# Altium schematic sheet 1.5KW CHE.SchDoc
size A2; PageSetup: Record=PageOptions|CenterHorizontal=True|CenterVertical=True|PrintScale=0.71|XCorrection=1.00|YCorrection=1.00|PrintKind=1|BorderSize=5000000|LeftOffset=0|BottomOffset=0|Orientation=2|PaperLength=1000|PaperWidth=1000|Scale=100|PaperSource=15|PrintQuality=600|MediaType=1|DitherType=10|PaperKind=A3|PrintScaleMode=1
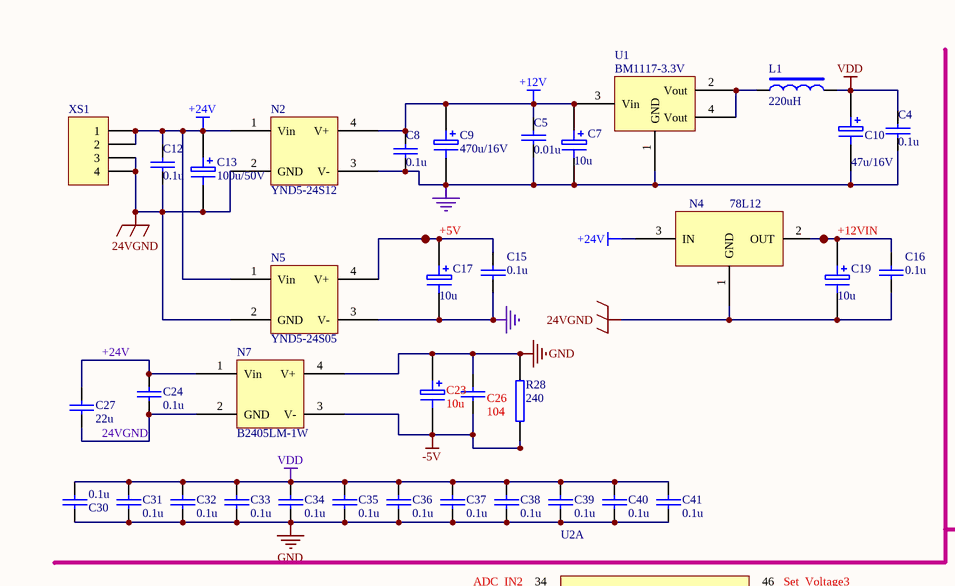
[diagram p0: 1.5KW CHE.SchDoc, top left]
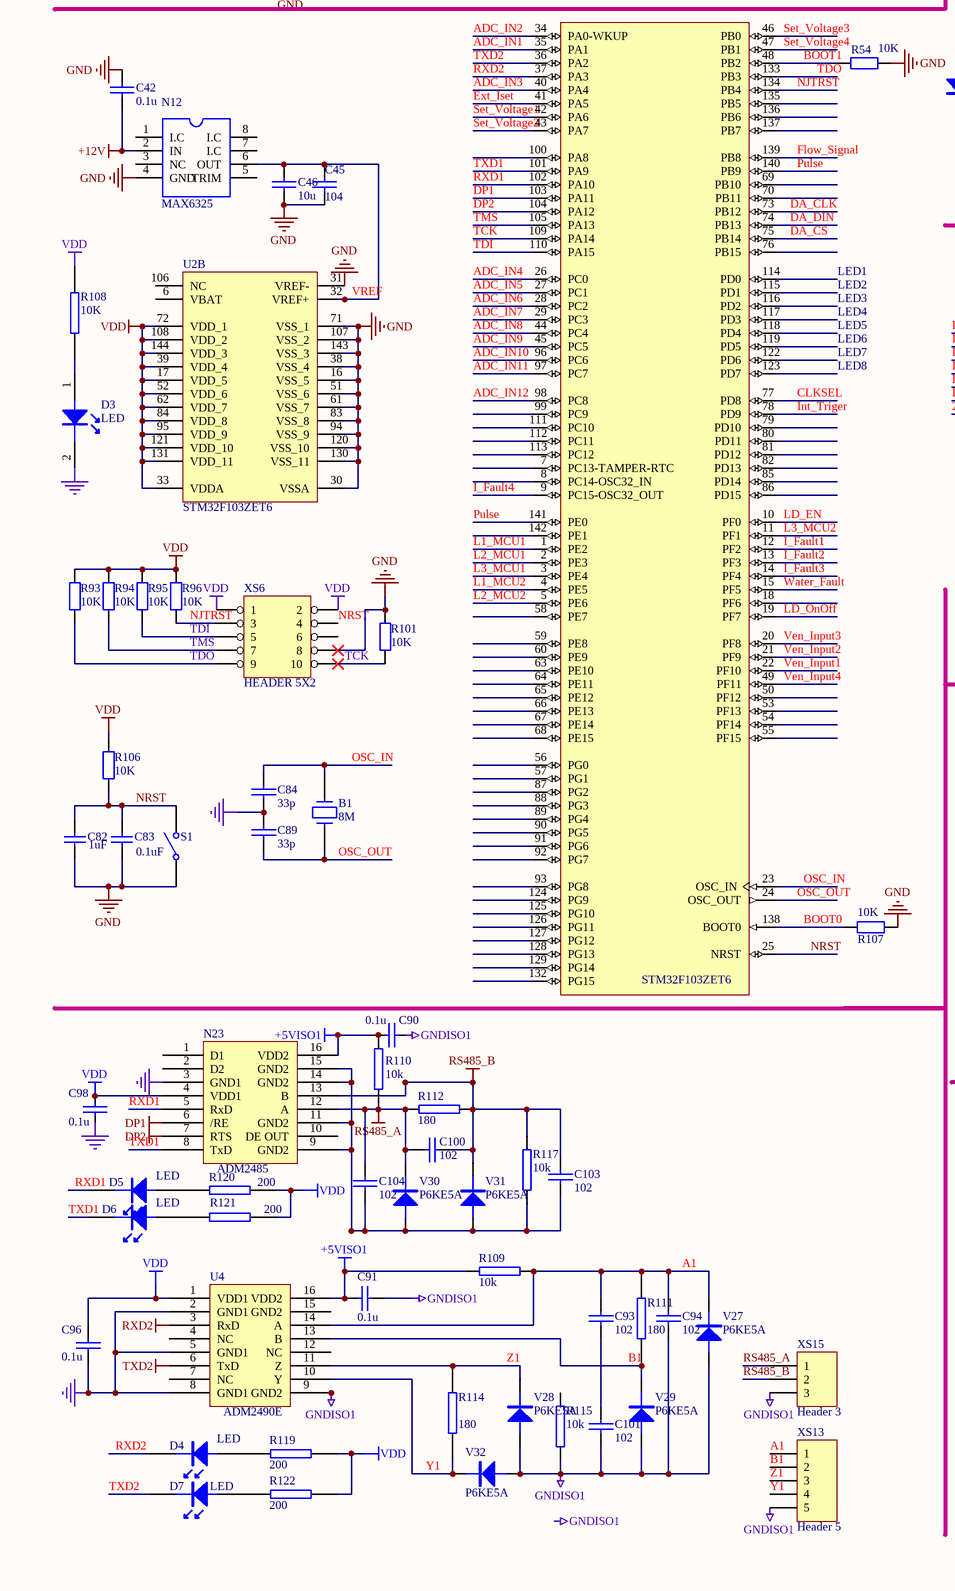
[diagram p1: 1.5KW CHE.SchDoc, bottom left]
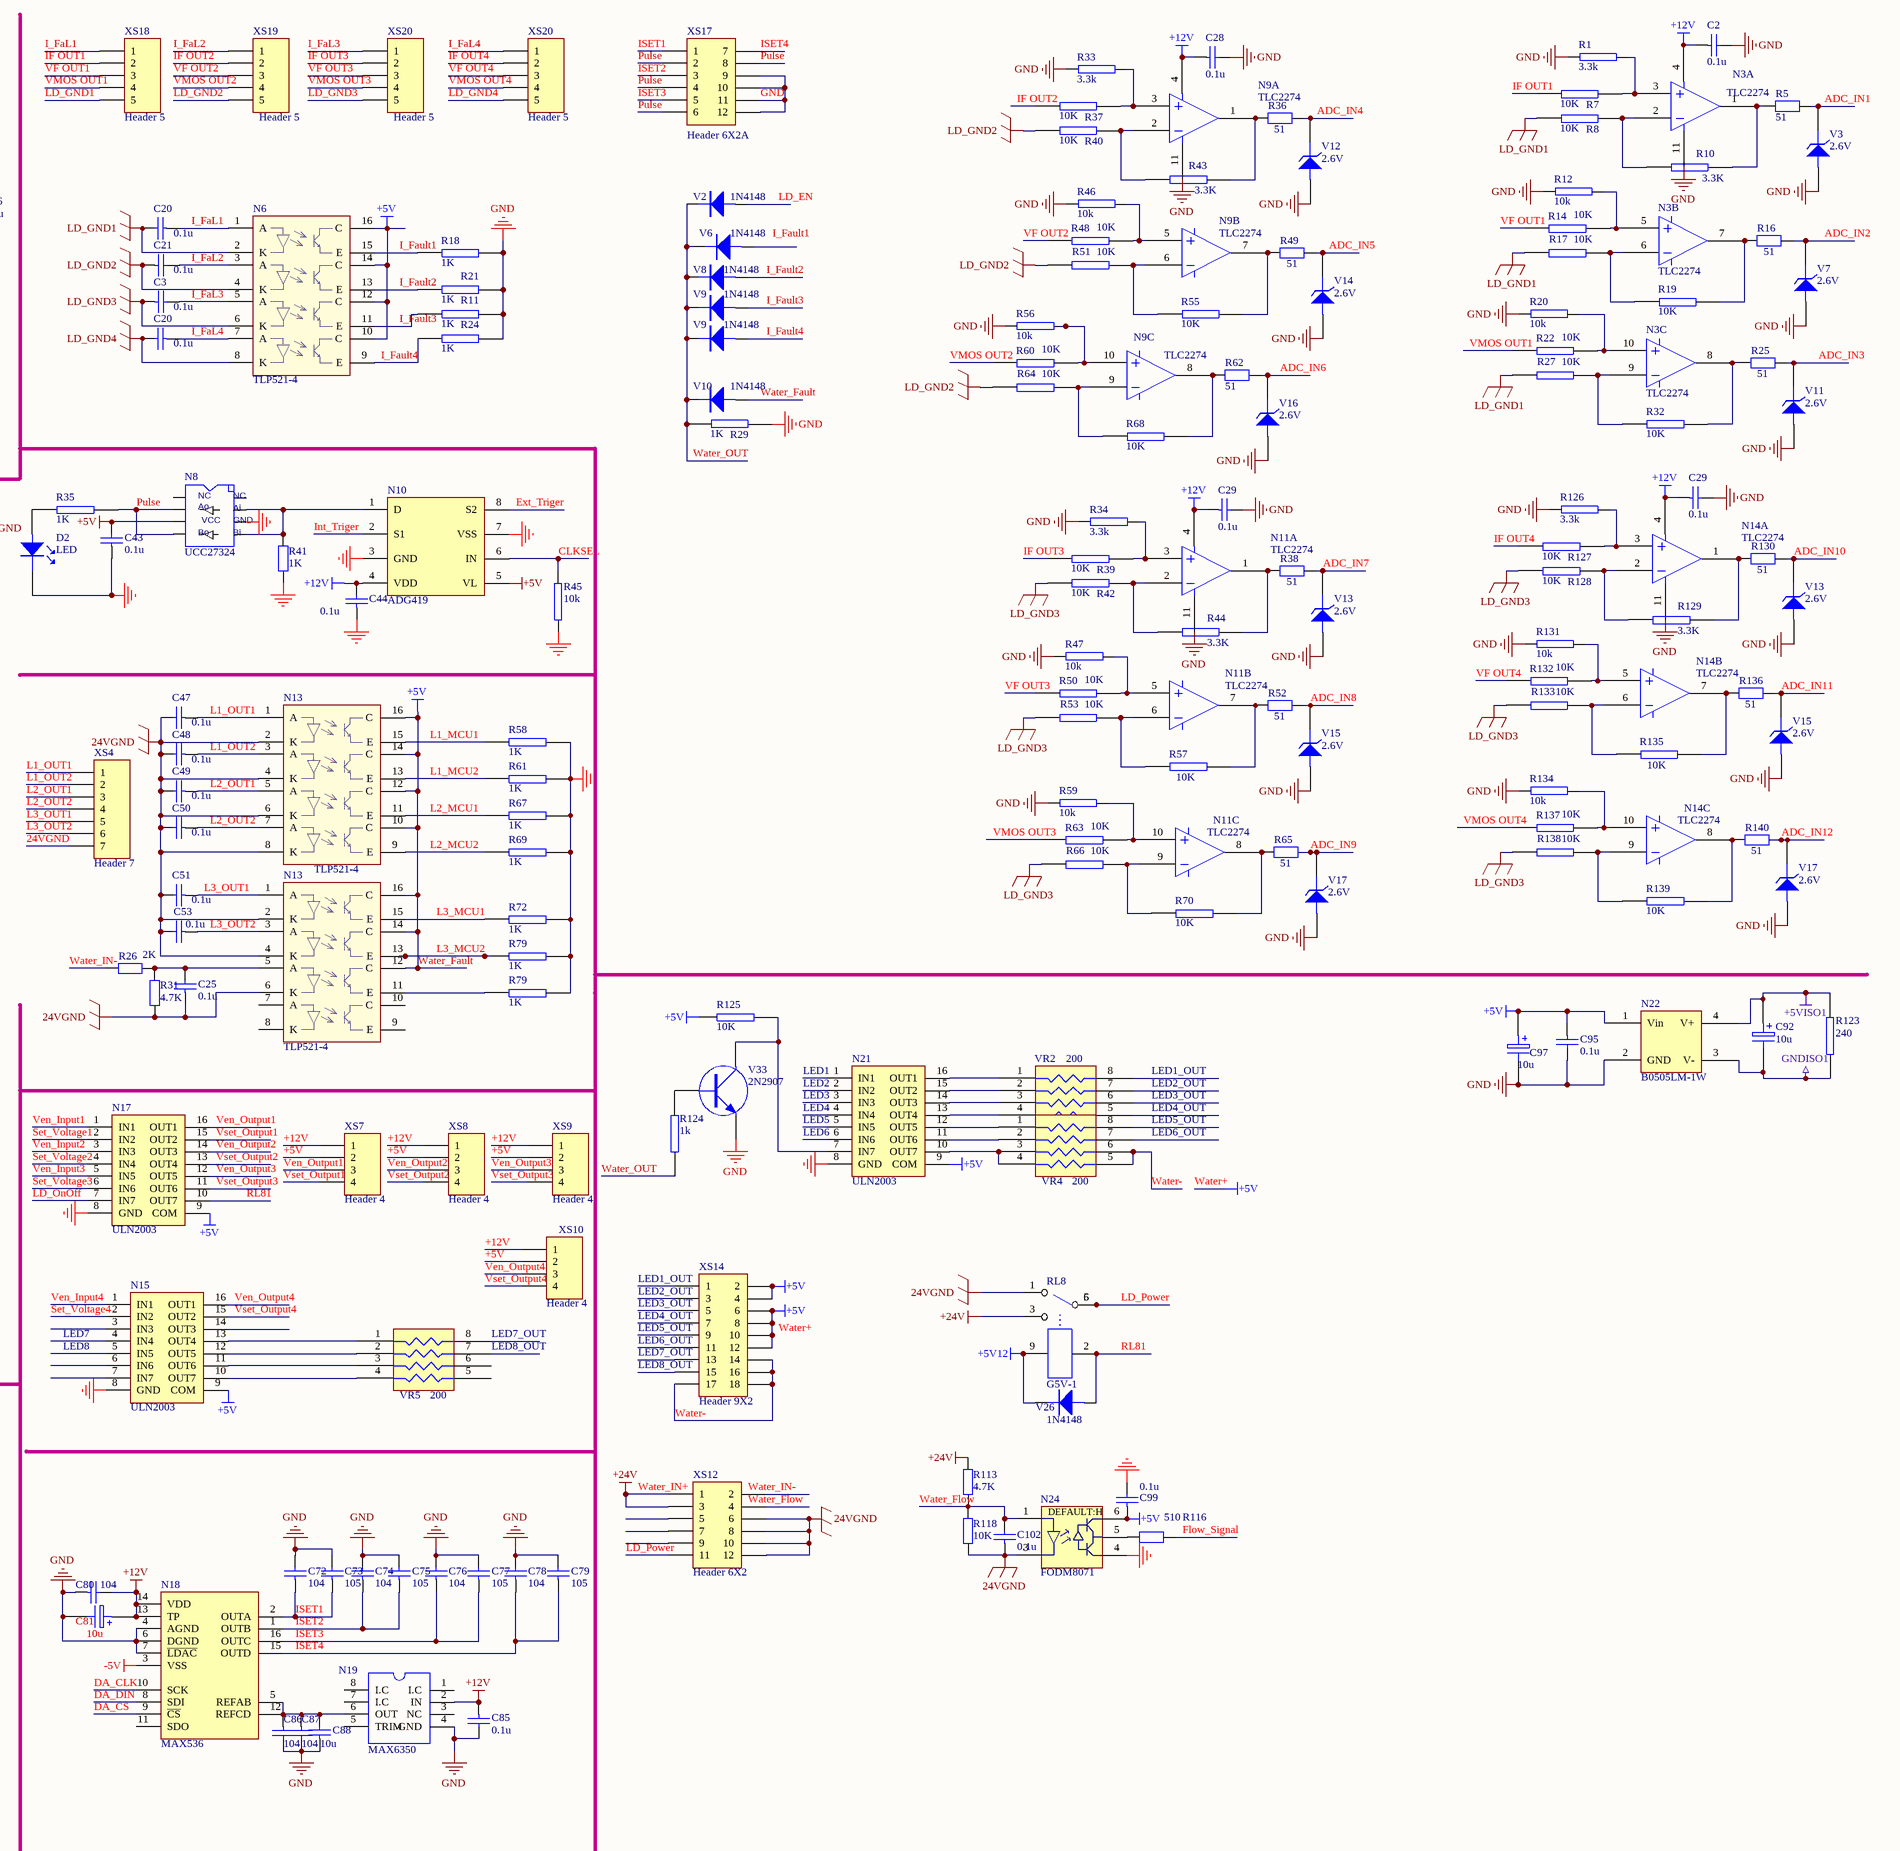
[diagram p2: 1.5KW CHE.SchDoc, bottom right]

## Parts
(Parts that share a designator on the sheet are numbered #1, #2 ... from top to bottom, then left to right.)
B1  8M  [CRY_SMB]
C2  0.1u  [0805]
C3  0.1u  [0805]
C4  0.1u  [0805]
C5  0.01u  [0805]
C7  10u  [1206]
C8  0.1u  [0805]
C9  470u/16V  [3008]
C10  47u/16V  [1206]
C12  0.1u  [0805]
C13  100u/50V  [CD5-8]
C15  0.1u  [0805]
C16  0.1u  [0805]
C17  10u  [1206]
C19  10u  [1206]
C20#1  0.1u  [0805]
C20#2  0.1u  [0805]
C21  0.1u  [0805]
C23  10u  [1206]
C24  0.1u  [0805]
C25  0.1u  [0805]
C26  104  [0805]
C27  22u  [1206]
C28  0.1u  [0805]
C29#1  0.1u  [0805]
C29#2  0.1u  [0805]
C30  0.1u  [0805]
C31  0.1u  [0805]
C32  0.1u  [0805]
C33  0.1u  [0805]
C34  0.1u  [0805]
C35  0.1u  [0805]
C36  0.1u  [0805]
C37  0.1u  [0805]
C38  0.1u  [0805]
C39  0.1u  [0805]
C40  0.1u  [0805]
C41  0.1u  [0805]
C42  0.1u  [0805]
C43  0.1u  [0805]
C44  0.1u  [0805]
C45  104  [0805]
C46  10u  [0805]
C47  0.1u  [0805]
C48  0.1u  [0805]
C49  0.1u  [0805]
C50  0.1u  [0805]
C51  0.1u  [0805]
C53  0.1u  [0805]
C72  104  [0805]
C73  105  [0805]
C74  104  [0805]
C75  105  [0805]
C76  104  [0805]
C77  105  [0805]
C78  104  [0805]
C79  105  [0805]
C80  104  [0805]
C81  10u  [1206]
C82  1uF  [0805]
C83  0.1uF  [0805]
C84  33p  [0805]
C85  0.1u  [0805]
C86  104  [0805]
C87  104  [0805]
C88  10u  [0805]
C89  33p  [0805]
C90  0.1u  [0805]
C91  0.1u  [0805]
C92  10u  [1206]
C93  102  [0805]
C94  102  [0805]
C95  0.1u  [0805]
C96  0.1u  [0805]
C97  10u  [1206]
C98  0.1u  [0805]
C99  0.1u  [0805]
C100  102  [0805]
C101  102  [0805]
C102  0.1u  [0805]
C103  102  [0805]
C104  102  [0805]
D2  LED  [1206A]
D3  LED  [1206A]
D4  LED  [1206A]
D5  LED  [1206A]
D6  LED  [1206A]
D7  LED  [1206A]
L1  220uH  [1812]
N2  YND5-24S12  [YND5]
N3  TLC2274  [SO-14]  (parts A,B,C of 4)
N4  78L12  [TO-92_2]
N5  YND5-24S05  [YND5]
N6  TLP521-4  [ILEAD-16]
N7  B2405LM-1W  [B0505LM]
N8  UCC27324  [SO-8]
N9  TLC2274  [SO-14]  (parts A,B,C of 4)
N10  ADG419  [SO-8]
N11  TLC2274  [SO-14]  (parts A,B,C of 4)
N12  MAX6325  [SO-8]
N13#1  TLP521-4  [ILEAD-16]
N13#2  TLP521-4  [ILEAD-16]
N14  TLC2274  [SO-14]  (parts A,B,C of 4)
N15  ULN2003  [SOIC127P600-16N]
N17  ULN2003  [SOIC127P600-16N]
N18  MAX536  [SOIC-16]
N19  MAX6350  [SO-8]
N21  ULN2003  [SOIC127P600-16N]
N22  B0505LM-1W  [B0505LM]
N23  ADM2485  [SOIC-16]
N24  FODM8071  [SO-8]
R1  3.3k  [0805]
R5  51  [0805]
R7  10K  [0805]
R8  10K  [0805]
R10  3.3K  [0805]
R11  1K  [0805]
R12  10k  [0805]
R14  10K  [0805]
R16  51  [0805]
R17  10K  [0805]
R18  1K  [0805]
R19  10K  [0805]
R20  10k  [0805]
R21  1K  [0805]
R22  10K  [0805]
R24  1K  [0805]
R25  51  [0805]
R26  2K  [0805]
R27  10K  [0805]
R28  240  [1206]
R29  1K  [0805]
R31  4.7K  [0805]
R32  10K  [0805]
R33  3.3k  [0805]
R34  3.3k  [0805]
R35  1K  [0805]
R36  51  [0805]
R37  10K  [0805]
R38  51  [0805]
R39  10K  [0805]
R40  10K  [0805]
R41  1K  [0805]
R42  10K  [0805]
R43  3.3K  [0805]
R44  3.3K  [0805]
R45  10k  [0805]
R46  10k  [0805]
R47  10k  [0805]
R48  10K  [0805]
R49  51  [0805]
R50  10K  [0805]
R51  10K  [0805]
R52  51  [0805]
R53  10K  [0805]
R54  10K  [0805]
R55  10K  [0805]
R56  10k  [0805]
R57  10K  [0805]
R58  1K  [0805]
R59  10k  [0805]
R60  10K  [0805]
R61  1K  [0805]
R62  51  [0805]
R63  10K  [0805]
R64  10K  [0805]
R65  51  [0805]
R66  10K  [0805]
R67  1K  [0805]
R68  10K  [0805]
R69  1K  [0805]
R70  10K  [0805]
R72  1K  [0805]
R79#1  1K  [0805]
R79#2  1K  [0805]
R93  10K  [0805]
R94  10K  [0805]
R95  10K  [0805]
R96  10K  [0805]
R101  10K  [0805]
R106  value 10K  [0805]  (hidden comment: Res2)
R107  10K  [0805]
R108  10K  [0805]
R109  10k  [0805]
R110  10k  [0805]
R111  180  [1206]
R112  180  [1206]
R113  4.7K  [0805]
R114  180  [1206]
R115  10k  [0805]
R116  510  [0805]
R117  10k  [0805]
R118  10K  [0805]
R119  200  [0805]
R120  200  [0805]
R121  200  [0805]
R122  200  [0805]
R123  240  [1206]
R124  1k  [1206]
R125  10K  [0805]
R126  3.3k  [0805]
R127  10K  [0805]
R128  10K  [0805]
R129  3.3K  [0805]
R130  51  [0805]
R131  10k  [0805]
R132  10K  [0805]
R133  10K  [0805]
R134  10k  [0805]
R135  10K  [0805]
R136  51  [0805]
R137  10K  [0805]
R138  10K  [0805]
R139  10K  [0805]
R140  51  [0805]
RL8  G5V-1  [G5V-1]
S1  SW-SPST  [KEY_3*6*2.5]  (value not drawn)
U1  BM1117-3.3V  [SOT-223]
U2  STM32F103ZET6  [LQFP144_N]  (parts A,B of 2)
U4  ADM2490E  [SOIC-16]
V2  1N4148  [1206A]
V3  2.6V  [1206A]
V6  1N4148  [1206A]
V7  2.6V  [1206A]
V8  1N4148  [1206A]
V9#1  1N4148  [1206A]
V9#2  1N4148  [1206A]
V10  1N4148  [1206A]
V11  2.6V  [1206A]
V12  2.6V  [1206A]
V13#1  2.6V  [1206A]
V13#2  2.6V  [1206A]
V14  2.6V  [1206A]
V15#1  2.6V  [1206A]
V15#2  2.6V  [1206A]
V16  2.6V  [1206A]
V17#1  2.6V  [1206A]
V17#2  2.6V  [1206A]
V26  1N4148  [1206A]
V27  P6KE5A  [1206-D]
V28  P6KE5A  [1206-D]
V29  P6KE5A  [1206-D]
V30  P6KE5A  [1206-D]
V31  P6KE5A  [1206-D]
V32  P6KE5A  [1206-D]
V33  2N2907  [SOT-23]
VR2  200  [MINZIP]
VR4  200  [MINZIP]
VR5  200  [MINZIP]
XS1  Header 4  [SIP-4]  (value not drawn)
XS4  Header 7  [SIP-7]
XS6  HEADER 5X2  [PHD-2*5]
XS7  Header 4  [SIP-4]
XS8  Header 4  [SIP-4]
XS9  Header 4  [SIP-4]
XS10  Header 4  [SIP-4]
XS12  Header 6X2  [PHD-2*6]
XS13  Header 5  [SIP-5]
XS14  Header 9X2  [PHD-2*9]
XS15  Header 3  [SIP-3]
XS17  Header 6X2A  [HDR2X6_CEN]
XS18  Header 5  [SIP-5]
XS19  Header 5  [SIP-5]
XS20#1  Header 5  [SIP-5]
XS20#2  Header 5  [SIP-5]

## Nets
24VGND: C12.2 C13.2 C16.2 C19.2 C24.1 C25.1 C27.1 C47.2 C48.2 C49.2 C50.2 C51.2 C53.2 C102.1 N2.2(GND) N4.1(GND) N5.2(GND) N7.2(GND) N13#1.2(K) N13#1.4(K) N13#1.6(K) N13#1.8(K) N13#2.2(K) N13#2.4(K) N13#2.6(K) N24.3(IN-) R31.2 R118.2 RL8.1 XS1.3 XS1.4 XS4.7 XS12.6 XS12.8 XS12.10 XS12.12
+5V: C15.1 C17.1 C43.2 C95.1 C97.1 C99.1 N5.4(V+) N6.10(C) N6.12(C) N6.14(C) N6.16(C) N8.6(VCC) N10.5(VL) N13#1.10(C) N13#1.12(C) N13#1.14(C) N13#1.16(C) N13#2.12(C) N13#2.14(C) N13#2.16(C) N15.9(COM) N17.9(COM) N21.9(COM) N22.1(Vin) N24.6(VDD) U2.15(PF5) V10.1(A) XS7.2 XS8.2 XS9.2 XS10.2 XS14.2 XS14.4 XS14.6 XS14.8 XS14.10 XS14.12  [also labelled Water+, Water_Fault]
+5V12: RL8.9 V26.2(K)
+5VISO1: C90.2 C91.2 C92.1 N22.4(V+) N23.16(VDD2) R109.1 R110.1 R123.2 U4.16(VDD2)
+12V: C2.1 C5.1 C7.1 C8.1 C9.1 C28.1 C29#1.1 C29#2.1 C42.1 C44.2 C80.2 C81.1 C85.1 N2.4(V+) N3.4 N9.4 N10.4(VDD) N11.4 N12.2(IN) N14.4 N18.13(TP) N18.14(VDD) N19.2(IN) U1.3(Vin) XS7.1 XS8.1 XS9.1 XS10.1
+24V: C12.1 C13.1 C24.2 C27.2 N2.1(Vin) N4.3(IN) N5.1(Vin) N7.1(Vin) R113.2 RL8.3 XS1.1 XS1.2 XS12.1 XS12.3  [also labelled Water_IN+]
-5V: C23.2 C26.2 N7.3(V-) N18.3(VSS) R28.1
DP1: N23.6(/RE) U2.103(PA11)
DP2: N23.7(RTS) U2.104(PA12)
GND: C2.2 C4.2 C5.2 C7.2 C8.2 C9.2 C10.2 C15.2 C17.2 C23.1 C26.1 C28.2 C29#1.2 C29#2.2 C30.2 C31.2 C32.2 C33.2 C34.2 C35.2 C36.2 C37.2 C38.2 C39.2 C40.2 C41.2 C42.2 C43.1 C44.1 C45.2 C46.1 C72.2 C73.2 C74.2 C75.2 C76.2 C77.2 C78.2 C79.2 C80.1 C81.2 C82.1 C83.1 C84.2 C85.2 C86.2 C87.2 C88.1 C89.1 C95.2 C96.2 C97.2 C98.2 C99.2 D2.2 D3.2 N2.3(V-) N3.11 N5.3(V-) N7.4(V+) N8.3(GND) N9.11 N10.3(GND) N10.7(VSS) N11.11 N12.4(GND) N14.11 N15.8(GND) N17.8(GND) N18.4(AGND) N18.6(DGND) N18.7(~{LDAC}) N19.4(GND) N21.8(GND) N22.2(GND) N23.3(GND1) N24.4(GND) R1.2 R11.2 R12.2 R18.2 R20.2 R21.2 R24.2 R28.2 R29.1 R33.2 R34.2 R41.2 R45.1 R46.2 R47.2 R54.1 R56.2 R58.2 R59.2 R61.2 R67.2 R69.2 R72.2 R79#1.2 R79#2.2 R101.1 R107.1 R126.2 R131.2 R134.2 S1.1(COMMON) U1.1(GND) U2.16(VSS_5) U2.30(VSSA) U2.31(VREF-) U2.38(VSS_4) U2.51(VSS_6) U2.61(VSS_7) U2.71(VSS_1) U2.83(VSS_8) U2.94(VSS_9) U2.107(VSS_2) U2.120(VSS_10) U2.130(VSS_11) U2.143(VSS_3) U4.2(GND1) U4.5(GND1) U4.8(GND1) V3.1(A) V7.1(A) V11.1(A) V12.1(A) V13#1.1(A) V13#2.1(A) V14.1(A) V15#1.1(A) V15#2.1(A) V16.1(A) V17#1.1(A) V17#2.1(A) V33.2(E) XS6.8 XS17.9 XS17.10 XS17.11 XS17.12
GNDISO1: C90.1 C91.1 C92.2 C94.2 C101.2 N22.3(V-) R115.2 R123.1 U4.9(GND2) V27.A V28.A V29.A V32.A XS13.5 XS15.3
LD_GND1: C20#1.2 N6.2(K) R8.1 R17.1 R27.1 XS18.5
LD_GND2: C21.1 N6.4(K) R40.1 R51.1 R64.1 XS19.5
LD_GND3: C3.1 N6.6(K) R42.1 R53.1 R66.1 R128.1 R133.1 R138.1 XS20#1.5
LD_GND4: C20#2.2 N6.8(K) XS20#2.5
RS485_A: C100.1 C104.1 N23.12(A) R110.2 R112.1 V30.K XS15.1
RS485_B: C100.2 C103.1 N23.13(B) R112.2 R117.1 V31.K XS15.2
RXD2: D4.2 U2.37(PA3) U4.3(RxD)
TXD2: D7.2 U2.36(PA2) U4.6(TxD)
VDD: C4.1 C10.1 C30.1 C31.1 C32.1 C33.1 C34.1 C35.1 C36.1 C37.1 C38.1 C39.1 C40.1 C41.1 C96.1 C98.1 L1.2 N23.4(VDD1) R93.1 R94.1 R95.1 R96.1 R106.2 R108.1 R119.2 R120.2 R121.2 R122.2 U2.17(VDD_5) U2.33(VDDA) U2.39(VDD_4) U2.52(VDD_6) U2.62(VDD_7) U2.72(VDD_1) U2.84(VDD_8) U2.95(VDD_9) U2.108(VDD_2) U2.121(VDD_10) U2.131(VDD_11) U2.144(VDD_3) U4.1(VDD1) XS6.1 XS6.2
+12VIN: C16.1 C19.1 N4.2(OUT)
A1: C93.1 C94.1 R109.2 R111.1 U4.14(A) V27.K XS13.1
ADC_IN1: R5.1 U2.35(PA1) V3.2(K)
ADC_IN2: R16.1 U2.34(PA0-WKUP) V7.2(K)
ADC_IN3: R25.1 U2.40(PA4) V11.2(K)
ADC_IN4: R36.1 U2.26(PC0) V12.2(K)
ADC_IN5: R49.1 U2.27(PC1) V14.2(K)
ADC_IN6: R62.1 U2.28(PC2) V16.2(K)
ADC_IN7: R38.1 U2.29(PC3) V13#2.2(K)
ADC_IN8: R52.1 U2.44(PC4) V15#2.2(K)
ADC_IN9: R65.1 U2.45(PC5) V17#2.2(K)
ADC_IN10: R130.1 U2.96(PC6) V13#1.2(K)
ADC_IN11: R136.1 U2.97(PC7) V15#1.2(K)
ADC_IN12: R140.1 U2.98(PC8) V17#1.2(K)
B1: R111.2 U4.13(B) V29.K XS13.2
BOOT0: R107.2 U2.138(BOOT0)
BOOT1: R54.2 U2.48(PB2)
CLKSEL: N10.6(IN) R45.2 U2.77(PD8)
DA_CLK: N18.10(SCK) U2.73(PB12)
DA_CS: N18.9(~{CS}) U2.75(PB14)
DA_DIN: N18.8(SDI) U2.74(PB13)
Ext_Iset: U2.41(PA5)
Ext_Triger: N10.8(S2)
Flow_Signal: R116.1 U2.139(PB8)
I_FaL1: C20#1.1 N6.1(A) XS18.1
I_FaL2: C21.2 N6.3(A) XS19.1
I_FaL3: C3.2 N6.5(A) XS20#1.1
I_FaL4: C20#2.1 N6.7(A) XS20#2.1
I_Fault1: N6.15(E) R18.1 U2.12(PF2)
I_Fault2: N6.13(E) R21.1 U2.13(PF3) V8.1(A)
I_Fault3: N6.11(E) R11.1 U2.14(PF4) V9#1.1(A)
I_Fault4: N6.9(E) R24.1 U2.9(PC15-OSC32_OUT) V9#2.1(A)
IF OUT1: R7.1 XS18.2
IF OUT2: R37.1 XS19.2
IF OUT3: R39.1 XS20#1.2
IF OUT4: R127.1 XS20#2.2
Int_Triger: N10.2(S1) U2.78(PD9)
ISET1: C72.1 C73.1 N18.2(OUTA) XS17.ISET1(1)
ISET2: C74.1 C75.1 N18.1(OUTB) XS17.3
ISET3: C76.1 C77.1 N18.16(OUTC) XS17.5
ISET4: C78.1 C79.1 N18.15(OUTD) XS17.7
L1_MCU1: N13#1.15(E) R58.1 U2.1(PE2)
L1_MCU2: N13#1.13(E) R61.1 U2.4(PE5)
L1_OUT1: C47.1 N13#1.1(A) XS4.1
L1_OUT2: C48.1 N13#1.3(A) XS4.2
L2_MCU1: N13#1.11(E) R67.1 U2.2(PE3)
L2_MCU2: N13#1.9(E) R69.1 U2.5(PE6)
L2_OUT1: C49.1 N13#1.5(A) XS4.3
L2_OUT2: C50.1 N13#1.7(A) XS4.4
L3_MCU1: N13#2.15(E) R72.1 U2.3(PE4)
L3_MCU2: N13#2.13(E) R79#1.1 U2.11(PF1)
L3_OUT1: C51.1 N13#2.1(A) XS4.5
L3_OUT2: C53.1 N13#2.3(A) XS4.6
LD_EN: U2.10(PF0) V2.1(A)
LD_OnOff: N17.7(IN7) U2.19(PF7)
LD_Power: RL8.5 RL8.6 XS12.11
LED1: N21.1(IN1) U2.114(PD0)
LED1_OUT: VR2.8 XS14.1
LED2: N21.2(IN2) U2.115(PD1)
LED2_OUT: VR2.7 XS14.3
LED3: N21.3(IN3) U2.116(PD2)
LED3_OUT: VR2.6 XS14.5
LED4: N21.4(IN4) U2.117(PD3)
LED4_OUT: VR2.5 XS14.7
LED5: N21.5(IN5) U2.118(PD4)
LED5_OUT: VR4.8 XS14.9
LED6: N21.6(IN6) U2.119(PD5)
LED6_OUT: VR4.7 XS14.11
LED7: N15.4(IN4) U2.122(PD6)
LED7_OUT: VR5.8 XS14.13
LED8: N15.5(IN5) U2.123(PD7)
LED8_OUT: VR5.7 XS14.15
NJTRST: R96.2 U2.134(PB4) XS6.3
NRST: C82.2 C83.2 R106.1 S1.2(NO) U2.25(NRST) XS6.4
OSC_IN: B1.2 C84.1 U2.23(OSC_IN)
OSC_OUT: B1.1 C89.2 U2.24(OSC_OUT)
Pulse: N8.5(Bout) N8.7(Aout) R35.2 U2.140(PB9) U2.141(PE0) XS17.2 XS17.4 XS17.6 XS17.8
RL81: N17.10(OUT7) RL8.2 V26.1(A)
RXD1: D5.2 N23.5(RxD) U2.102(PA10)
Set_Voltage1: N17.2(IN2) U2.42(PA6)
Set_Voltage2: N17.4(IN4) U2.43(PA7)
Set_Voltage3: N17.6(IN6) U2.46(PB0)
Set_Voltage4: N15.2(IN2) U2.47(PB1)
TCK: R101.2 U2.109(PA14) XS6.10
TDI: R95.2 U2.110(PA15) XS6.5
TDO: R93.2 U2.133(PB3) XS6.9
TMS: R94.2 U2.105(PA13) XS6.7
TXD1: D6.2 N23.8(TxD) U2.101(PA9)
Ven_Input1: N17.1(IN1) U2.22(PF10)
Ven_Input2: N17.3(IN3) U2.21(PF9)
Ven_Input3: N17.5(IN5) U2.20(PF8)
Ven_Input4: N15.1(IN1) U2.49(PF11)
Ven_Output1: N17.16(OUT1) XS7.3
Ven_Output2: N17.14(OUT3) XS8.3
Ven_Output3: N17.12(OUT5) XS9.3
Ven_Output4: N15.16(OUT1) XS10.3
VF OUT1: R14.1 XS18.3
VF OUT2: R48.1 XS19.3
VF OUT3: R50.1 XS20#1.3
VF OUT4: R132.1 XS20#2.3
VMOS OUT1: R22.1 XS18.4
VMOS OUT2: R60.1 XS19.4
VMOS OUT3: R63.1 XS20#1.4
VMOS OUT4: R137.1 XS20#2.4
VREF: C45.1 C46.2 N12.6(OUT) U2.32(VREF+)
Vset_Output1: N17.15(OUT2) XS7.4
Vset_Output2: N17.13(OUT4) XS8.4
Vset_Output3: N17.11(OUT6) XS9.4
Vset_Output4: N15.15(OUT2) XS10.4
Water-: VR4.5 VR4.6 XS14.14 XS14.16 XS14.17 XS14.18
Water_Flow: C102.2 N24.1(IN+) R113.1 R118.1
Water_IN-: R26.2
Water_OUT: R29.2 R124.2 V2.2(K) V6.2(K) V8.2(K) V9#1.2(K) V9#2.2(K) V10.2(K)
Y1: R114.2 U4.10(Y) V32.K XS13.4
Z1: R114.1 U4.11(Z) V28.K XS13.3
NetC25_2: C25.2 N13#2.5(A) R26.1 R31.1
NetC86_1: C86.1 C87.1 C88.2 N18.5(REFAB) N18.12(REFCD) N19.6(OUT)
NetC93_2: C93.2 C101.1
NetC103_2: C103.2 C104.2 N23.9(GND2) N23.11(GND2) N23.14(GND2) N23.15(GND2) R117.2 V30.A V31.A
NetD2_1: D2.1 R35.1
NetD3_1: D3.1 R108.2
NetD4_1: D4.1 R119.1
NetD5_1: D5.1 R120.1
NetD6_1: D6.1 R121.1
NetD7_1: D7.1 R122.1
NetL1_1: L1.1 U1.2(Vout) U1.4(Vout)
NetN3_1: N3.1 R5.2 R10.2
NetN3_2: N3.2 R8.2 R10.1
NetN3_3: N3.3 R1.1 R7.2
NetN3_5: N3.5 R12.1 R14.2
NetN3_6: N3.6 R17.2 R19.1
NetN3_7: N3.7 R16.2 R19.2
NetN3_8: N3.8 R25.2 R32.2
NetN3_9: N3.9 R27.2 R32.1
NetN3_10: N3.10 R20.1 R22.2
NetN8_2: N8.2(Ain) N8.4(Bin) N10.1(D) R41.1
NetN9_1: N9.1 R36.2 R43.2
NetN9_2: N9.2 R40.2 R43.1
NetN9_3: N9.3 R33.1 R37.2
NetN9_5: N9.5 R46.1 R48.2
NetN9_6: N9.6 R51.2 R55.1
NetN9_7: N9.7 R49.2 R55.2
NetN9_8: N9.8 R62.2 R68.2
NetN9_9: N9.9 R64.2 R68.1
NetN9_10: N9.10 R56.1 R60.2
NetN11_1: N11.1 R38.2 R44.2
NetN11_2: N11.2 R42.2 R44.1
NetN11_3: N11.3 R34.1 R39.2
NetN11_5: N11.5 R47.1 R50.2
NetN11_6: N11.6 R53.2 R57.1
NetN11_7: N11.7 R52.2 R57.2
NetN11_8: N11.8 R65.2 R70.2
NetN11_9: N11.9 R66.2 R70.1
NetN11_10: N11.10 R59.1 R63.2
NetN13#2_11: N13#2.11(E) R79#2.1
NetN14_1: N14.1 R129.2 R130.2
NetN14_2: N14.2 R128.2 R129.1
NetN14_3: N14.3 R126.1 R127.2
NetN14_5: N14.5 R131.1 R132.2
NetN14_6: N14.6 R133.2 R135.1
NetN14_7: N14.7 R135.2 R136.2
NetN14_8: N14.8 R139.2 R140.2
NetN14_9: N14.9 R138.2 R139.1
NetN14_10: N14.10 R134.1 R137.2
NetN15_10: N15.10(OUT7) VR5.4
NetN15_11: N15.11(OUT6) VR5.3
NetN15_12: N15.12(OUT5) VR5.2
NetN15_13: N15.13(OUT4) VR5.1
NetN21_7: N21.7(IN7) R125.2 V33.3(C)
NetN21_10: N21.10(OUT7) VR4.3 VR4.4
NetN21_11: N21.11(OUT6) VR4.2
NetN21_12: N21.12(OUT5) VR4.1
NetN21_13: N21.13(OUT4) VR2.4
NetN21_14: N21.14(OUT3) VR2.3
NetN21_15: N21.15(OUT2) VR2.2
NetN21_16: N21.16(OUT1) VR2.1
NetN24_5: N24.5(VO) R116.2
NetR124_1: R124.1 V33.1(B)

Not connected (* = marked no-connect by the designer): N8 1(NC) 8(NC); N12 1(I.C) 3(NC) 5(TRIM) 7(I.C) 8(I.C); N13#2 7(A) 8(K) 9(E) 10(C); N15 3(IN3) 6(IN6) 7(IN7) 14(OUT3); N18 11(SDO); N19 1(I.C) 3(NC) 5(TRIM) 7(I.C) 8(I.C); N23 1(D1) 2(D2) 10(DE_OUT); N24 2(NC); R115 1; R125 1; U2 6(VBAT) 7(PC13-TAMPER-RTC) 8(PC14-OSC32_IN) 18(PF6) 50(PF12) 53(PF13) 54(PF14) 55(PF15) 56(PG0) 57(PG1) 58(PE7) 59(PE8) 60(PE9) 63(PE10) 64(PE11) 65(PE12) 66(PE13) 67(PE14) 68(PE15) 69(PB10) 70(PB11) 76(PB15) 79(PD10) 80(PD11) 81(PD12) 82(PD13) 85(PD14) 86(PD15) 87(PG2) 88(PG3) 89(PG4) 90(PG5) 91(PG6) 92(PG7) 93(PG8) 99(PC9) 100(PA8) 106(NC) 111(PC10) 112(PC11) 113(PC12) 124(PG9) 125(PG10) 126(PG11) 127(PG12) 128(PG13) 129(PG14) 132(PG15) 135(PB5) 136(PB6) 137(PB7) 142(PE1); U4 4(NC) 7(NC) 12(NC) 15(GND2); V6 1(A); VR5 5 6; XS6 6; XS12 2 4 5 7 9

## Notes on the sheet
- Labels drawn without touching a wire or pin: +5V, GNDISO1, I_Fault1, Water+, Water_Flow, Water_IN-
- (in symbol FODM8071) DEFAULT:H
- (in symbol UCC27324) Ao; Ai; Bo; Bi

## Library data of the parts
B1 = CRYSTAL
C2-C5 C8 C12 C20#1 C20#2 C21 C24 C26-C28 C29#1 C29#2 C30-C41 C47-C51 C53 C84 C89 C91 C93-C96 C100 C101 C103 C104 = CAP: Capacitor
C7 C9 C10 C13 C17 C19 C23 C81 C92 C97 = ELECTRO1: Electrolytic Capacitor
C15 C16 C25 C42-C46 C72-C80 C85-C88 C90 C98 C99 C102 = CAP
C82 = Cap: Capacitor; Value: 0.1uF; Published: 8-Jun-2000; LatestRevisionDate: 17-Jul-2002; LatestRevisionNote: Re-released for DXP Platform.; PackageReference: RAD-0.3; Publisher: Altium Limited; PackageDescription: Radial Cap, Thru-Hole; 2 Leads; 0.3 in Pin Spacing
C83 = Cap: Capacitor; Published: 8-Jun-2000; LatestRevisionDate: 17-Jul-2002; LatestRevisionNote: Re-released for DXP Platform.; PackageReference: RAD-0.3; Publisher: Altium Limited; PackageDescription: Radial Cap, Thru-Hole; 2 Leads; 0.3 in Pin Spacing; Value: 0.1uF
L1 = L
N2 N5 N7 N22 = B0505LM
N3 N9 N11 N14 = LM124
N4 = VOL
N12 N19 = MAX6341
N15 N17 N21 = ULN2003A
R1 R12 R20 R33 R34 R45-R47 R56 R59 R109 R110 R115 R117 R126 R131 R134 = R
R5 R16 R25 R26 R31 R36 R38 R49 R52 R54 R62 R65 R93-R96 R101 R107 R113 R116 R118 R130 R136 R140 = Res2: Resistor; Value: 1K; Published: 8-Jun-2000; LatestRevisionDate: 17-Jul-2002; LatestRevisionNote: Re-released for DXP Platform.; PackageReference: AXIAL-0.4; Publisher: Altium Limited
R7 R8 R10 R11 R14 R17-R19 R21 R22 R24 R27-R29 R32 R35 R37 R39 R40 R42-R44 R48 R50 R51 R53 R55 R57 R58 R60 R61 R63 R64 R66-R70 R72 R79#1 R79#2 R108 R111 R112 R114 R119-R125 R127-R129 R132 R133 R135 R137-R139 = RES2
R41 R106 = Res2: Resistor; Published: 8-Jun-2000; LatestRevisionDate: 17-Jul-2002; LatestRevisionNote: Re-released for DXP Platform.; PackageReference: AXIAL-0.4; Publisher: Altium Limited
  R41: Value: 1K
  R106: PackageDescription: Axial Device, Thru-Hole; 2 Leads; 0.4 in Pin Spacing
S1 = SW-SPST: Single-Pole, Single-Throw Switch; Published: 24-Mar-1999; LatestRevisionDate: 17-Jul-2002; LatestRevisionNote: Re-released for DXP Platform.; PackageReference: SPST-2; Publisher: Altium Limited; PackageDescription: Switch; 2 Leads
U1 = BM1117
U2 = STM32F103ZET6: STM32 ARM-based 32-bit MCU Performance Line with 512 kB Flash, 64 kB Internal RAM, -40 to +85°C Temperature, 144-Pin LQFP, Tray; DatasheetVersion: rev8.0, Apr-2011; PackageVersion: 2011; PackageReference: LQFP144; PackageDescription: 144-Pin Thin Quad Flat Pack 0.5 mm Pitch; ComponentLink1Description: Manufacturer URL; ComponentLink1URL: http://www.st.com/; ComponentLink2Description: STM32F103 Datasheet; ComponentLink2URL: http://www.st.com/internet/com/TECHNICAL_RESOURCES/TECHNICAL_LITERATURE/DATASHEET/CD00191185.pdf; ComponentLink3Description: STM32 Family Web Page; ComponentLink3URL: www.st.com/stm32
V2 V6 V8 V9#1 V9#2 V10 V26 = D
V3 V7 V11 V12 V13#1 V13#2 V14 V15#1 V15#2 V16 V17#1 V17#2 = ZENER3: Zener Diode
V27-V32 = DIODE
V33 = NPN: NPN Transistor
VR2 VR4 VR5 = RN-742: Text Field1: 50; Text Field2: 50
XS1 XS7-XS10 = Header 4: Header, 4-Pin; LatestRevisionDate: 17-Jul-2002; LatestRevisionNote: Re-released for DXP Platform.; Publisher: Altium Limited
XS4 = Header 7: Header, 7-Pin; LatestRevisionDate: 17-Jul-2002; LatestRevisionNote: Re-released for DXP Platform.; Publisher: Altium Limited
XS12 = Header 6X2: Header, 6-Pin, Dual row; LatestRevisionDate: 17-Jul-2002; LatestRevisionNote: Re-released for DXP Platform.; Publisher: Altium Limited
XS13 XS18 XS19 XS20#1 XS20#2 = Header 5: Header, 5-Pin; LatestRevisionDate: 17-Jul-2002; LatestRevisionNote: Re-released for DXP Platform.; Publisher: Altium Limited
XS14 = Header 9X2: Header, 9-Pin, Dual row; LatestRevisionDate: 17-Jul-2002; LatestRevisionNote: Re-released for DXP Platform.; Publisher: Altium Limited
XS15 = Header 3: Header, 3-Pin; LatestRevisionDate: 17-Jul-2002; LatestRevisionNote: Re-released for DXP Platform.; Publisher: Altium Limited
XS17 = Header 6X2A: Header, 6-Pin, Dual row; LatestRevisionDate: 17-Jul-2002; LatestRevisionNote: Re-released for DXP Platform.; Publisher: Altium Limited